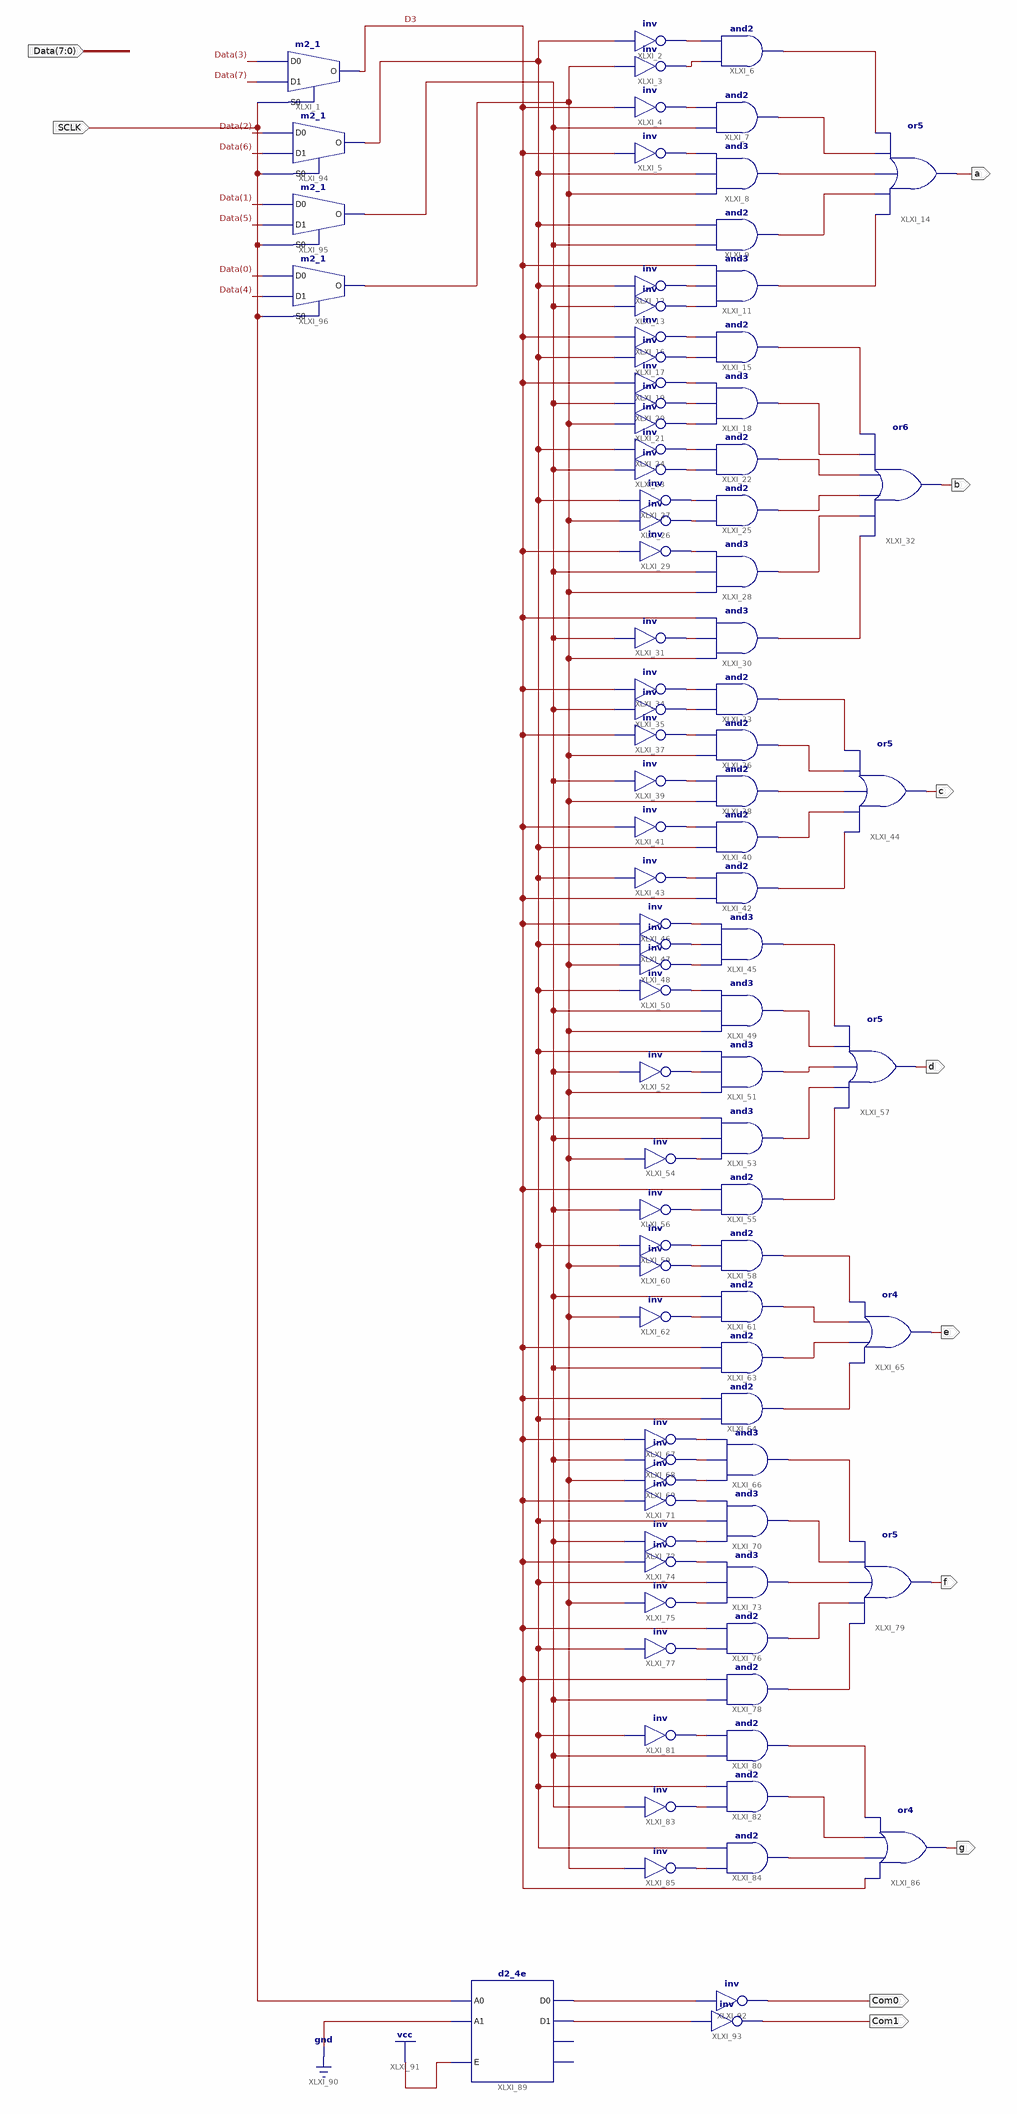
[diagram p0: schematic sheet 1]
// Xilinx ISE schematic bcd_to7seg_hex.sch (spartan6) as structural Verilog: 91 symbols, 11 ports
module bcd_to7seg_hex (
  input  [7:0] Data,
  input  SCLK,
  output a,
  output b,
  output c,
  output d,
  output e,
  output f,
  output g,
  output Com0,
  output Com1
);

  wire D0, D1, D2, D3, XLXN_21, XLXN_22, XLXN_23, XLXN_24, XLXN_25, XLXN_26, XLXN_27, XLXN_28, XLXN_29,
       XLXN_30, XLXN_31, XLXN_33, XLXN_34, XLXN_35, XLXN_36, XLXN_37, XLXN_38, XLXN_39, XLXN_40, XLXN_41,
       XLXN_42, XLXN_43, XLXN_44, XLXN_45, XLXN_46, XLXN_47, XLXN_48, XLXN_49, XLXN_51, XLXN_52, XLXN_53,
       XLXN_54, XLXN_55, XLXN_56, XLXN_57, XLXN_58, XLXN_59, XLXN_60, XLXN_61, XLXN_64, XLXN_65, XLXN_66,
       XLXN_67, XLXN_68, XLXN_69, XLXN_70, XLXN_71, XLXN_72, XLXN_73, XLXN_74, XLXN_75, XLXN_77, XLXN_78,
       XLXN_79, XLXN_80, XLXN_81, XLXN_82, XLXN_83, XLXN_85, XLXN_86, XLXN_87, XLXN_88, XLXN_89, XLXN_90,
       XLXN_91, XLXN_92, XLXN_93, XLXN_94, XLXN_95, XLXN_96, XLXN_97, XLXN_99, XLXN_100, XLXN_101, XLXN_102,
       XLXN_103, XLXN_104, XLXN_113, XLXN_114;

  m2_1 XLXI_1 (.D0(Data[3]), .D1(Data[7]), .S0(SCLK), .O(D3));
  not XLXI_2 (XLXN_21, D2);
  not XLXI_3 (XLXN_22, D0);
  not XLXI_4 (XLXN_23, D3);
  not XLXI_5 (XLXN_24, D3);
  and XLXI_6 (XLXN_27, XLXN_22, XLXN_21);
  and XLXI_7 (XLXN_28, D1, XLXN_23);
  and XLXI_8 (XLXN_29, D0, D2, XLXN_24);
  and XLXI_9 (XLXN_30, D1, D2);
  and XLXI_11 (XLXN_31, XLXN_26, XLXN_25, D3);
  not XLXI_12 (XLXN_25, D2);
  not XLXI_13 (XLXN_26, D1);
  or XLXI_14 (a, XLXN_31, XLXN_30, XLXN_29, XLXN_28, XLXN_27);
  and XLXI_15 (XLXN_44, XLXN_34, XLXN_33);
  not XLXI_16 (XLXN_33, D3);
  not XLXI_17 (XLXN_34, D2);
  and XLXI_18 (XLXN_45, XLXN_37, XLXN_36, XLXN_35);
  not XLXI_19 (XLXN_35, D3);
  not XLXI_20 (XLXN_36, D1);
  not XLXI_21 (XLXN_37, D0);
  and XLXI_22 (XLXN_46, XLXN_39, XLXN_38);
  not XLXI_23 (XLXN_39, D1);
  not XLXI_24 (XLXN_38, D2);
  and XLXI_25 (XLXN_47, XLXN_41, XLXN_40);
  not XLXI_26 (XLXN_41, D0);
  not XLXI_27 (XLXN_40, D2);
  and XLXI_28 (XLXN_48, D0, D1, XLXN_42);
  not XLXI_29 (XLXN_42, D3);
  and XLXI_30 (XLXN_49, D0, XLXN_43, D3);
  not XLXI_31 (XLXN_43, D1);
  or XLXI_32 (b, XLXN_49, XLXN_48, XLXN_47, XLXN_46, XLXN_45, XLXN_44);
  and XLXI_33 (XLXN_57, XLXN_52, XLXN_51);
  not XLXI_34 (XLXN_51, D3);
  not XLXI_35 (XLXN_52, D1);
  and XLXI_36 (XLXN_58, D0, XLXN_53);
  not XLXI_37 (XLXN_53, D3);
  and XLXI_38 (XLXN_59, D0, XLXN_54);
  not XLXI_39 (XLXN_54, D1);
  and XLXI_40 (XLXN_60, D2, XLXN_55);
  not XLXI_41 (XLXN_55, D3);
  and XLXI_42 (XLXN_61, D3, XLXN_56);
  not XLXI_43 (XLXN_56, D2);
  or XLXI_44 (c, XLXN_61, XLXN_60, XLXN_59, XLXN_58, XLXN_57);
  and XLXI_45 (XLXN_71, XLXN_66, XLXN_65, XLXN_64);
  not XLXI_46 (XLXN_64, D3);
  not XLXI_47 (XLXN_65, D2);
  not XLXI_48 (XLXN_66, D0);
  and XLXI_49 (XLXN_72, D0, D1, XLXN_67);
  not XLXI_50 (XLXN_67, D2);
  and XLXI_51 (XLXN_73, D0, XLXN_68, D2);
  not XLXI_52 (XLXN_68, D1);
  and XLXI_53 (XLXN_74, XLXN_69, D1, D2);
  not XLXI_54 (XLXN_69, D0);
  and XLXI_55 (XLXN_75, XLXN_70, D3);
  not XLXI_56 (XLXN_70, D1);
  or XLXI_57 (d, XLXN_75, XLXN_74, XLXN_73, XLXN_72, XLXN_71);
  and XLXI_58 (XLXN_80, XLXN_78, XLXN_77);
  not XLXI_59 (XLXN_77, D2);
  not XLXI_60 (XLXN_78, D0);
  and XLXI_61 (XLXN_81, XLXN_79, D1);
  not XLXI_62 (XLXN_79, D0);
  and XLXI_63 (XLXN_82, D1, D3);
  and XLXI_64 (XLXN_83, D2, D3);
  or XLXI_65 (e, XLXN_83, XLXN_82, XLXN_81, XLXN_80);
  and XLXI_66 (XLXN_93, XLXN_86, XLXN_87, XLXN_85);
  not XLXI_67 (XLXN_85, D3);
  not XLXI_68 (XLXN_87, D1);
  not XLXI_69 (XLXN_86, D0);
  and XLXI_70 (XLXN_94, XLXN_89, D2, XLXN_88);
  not XLXI_71 (XLXN_88, D3);
  not XLXI_72 (XLXN_89, D1);
  and XLXI_73 (XLXN_95, XLXN_90, D2, XLXN_91);
  not XLXI_74 (XLXN_91, D3);
  not XLXI_75 (XLXN_90, D0);
  and XLXI_76 (XLXN_96, XLXN_92, D3);
  not XLXI_77 (XLXN_92, D2);
  and XLXI_78 (XLXN_97, D1, D3);
  or XLXI_79 (f, XLXN_97, XLXN_96, XLXN_95, XLXN_94, XLXN_93);
  and XLXI_80 (XLXN_102, D1, XLXN_99);
  not XLXI_81 (XLXN_99, D2);
  and XLXI_82 (XLXN_103, XLXN_100, D2);
  not XLXI_83 (XLXN_100, D1);
  and XLXI_84 (XLXN_104, XLXN_101, D2);
  not XLXI_85 (XLXN_101, D0);
  or XLXI_86 (g, D3, XLXN_104, XLXN_103, XLXN_102);
  d2_4e XLXI_89 (.A0(SCLK), .A1(1'b0), .E(1'b1), .D0(XLXN_113), .D1(XLXN_114));  // open: D2, D3
  not XLXI_92 (Com0, XLXN_113);
  not XLXI_93 (Com1, XLXN_114);
  m2_1 XLXI_94 (.D0(Data[2]), .D1(Data[6]), .S0(SCLK), .O(D2));
  m2_1 XLXI_95 (.D0(Data[1]), .D1(Data[5]), .S0(SCLK), .O(D1));
  m2_1 XLXI_96 (.D0(Data[0]), .D1(Data[4]), .S0(SCLK), .O(D0));
endmodule
